# EAGLE design RGB LED 1.4 (EAGLE 5.04)
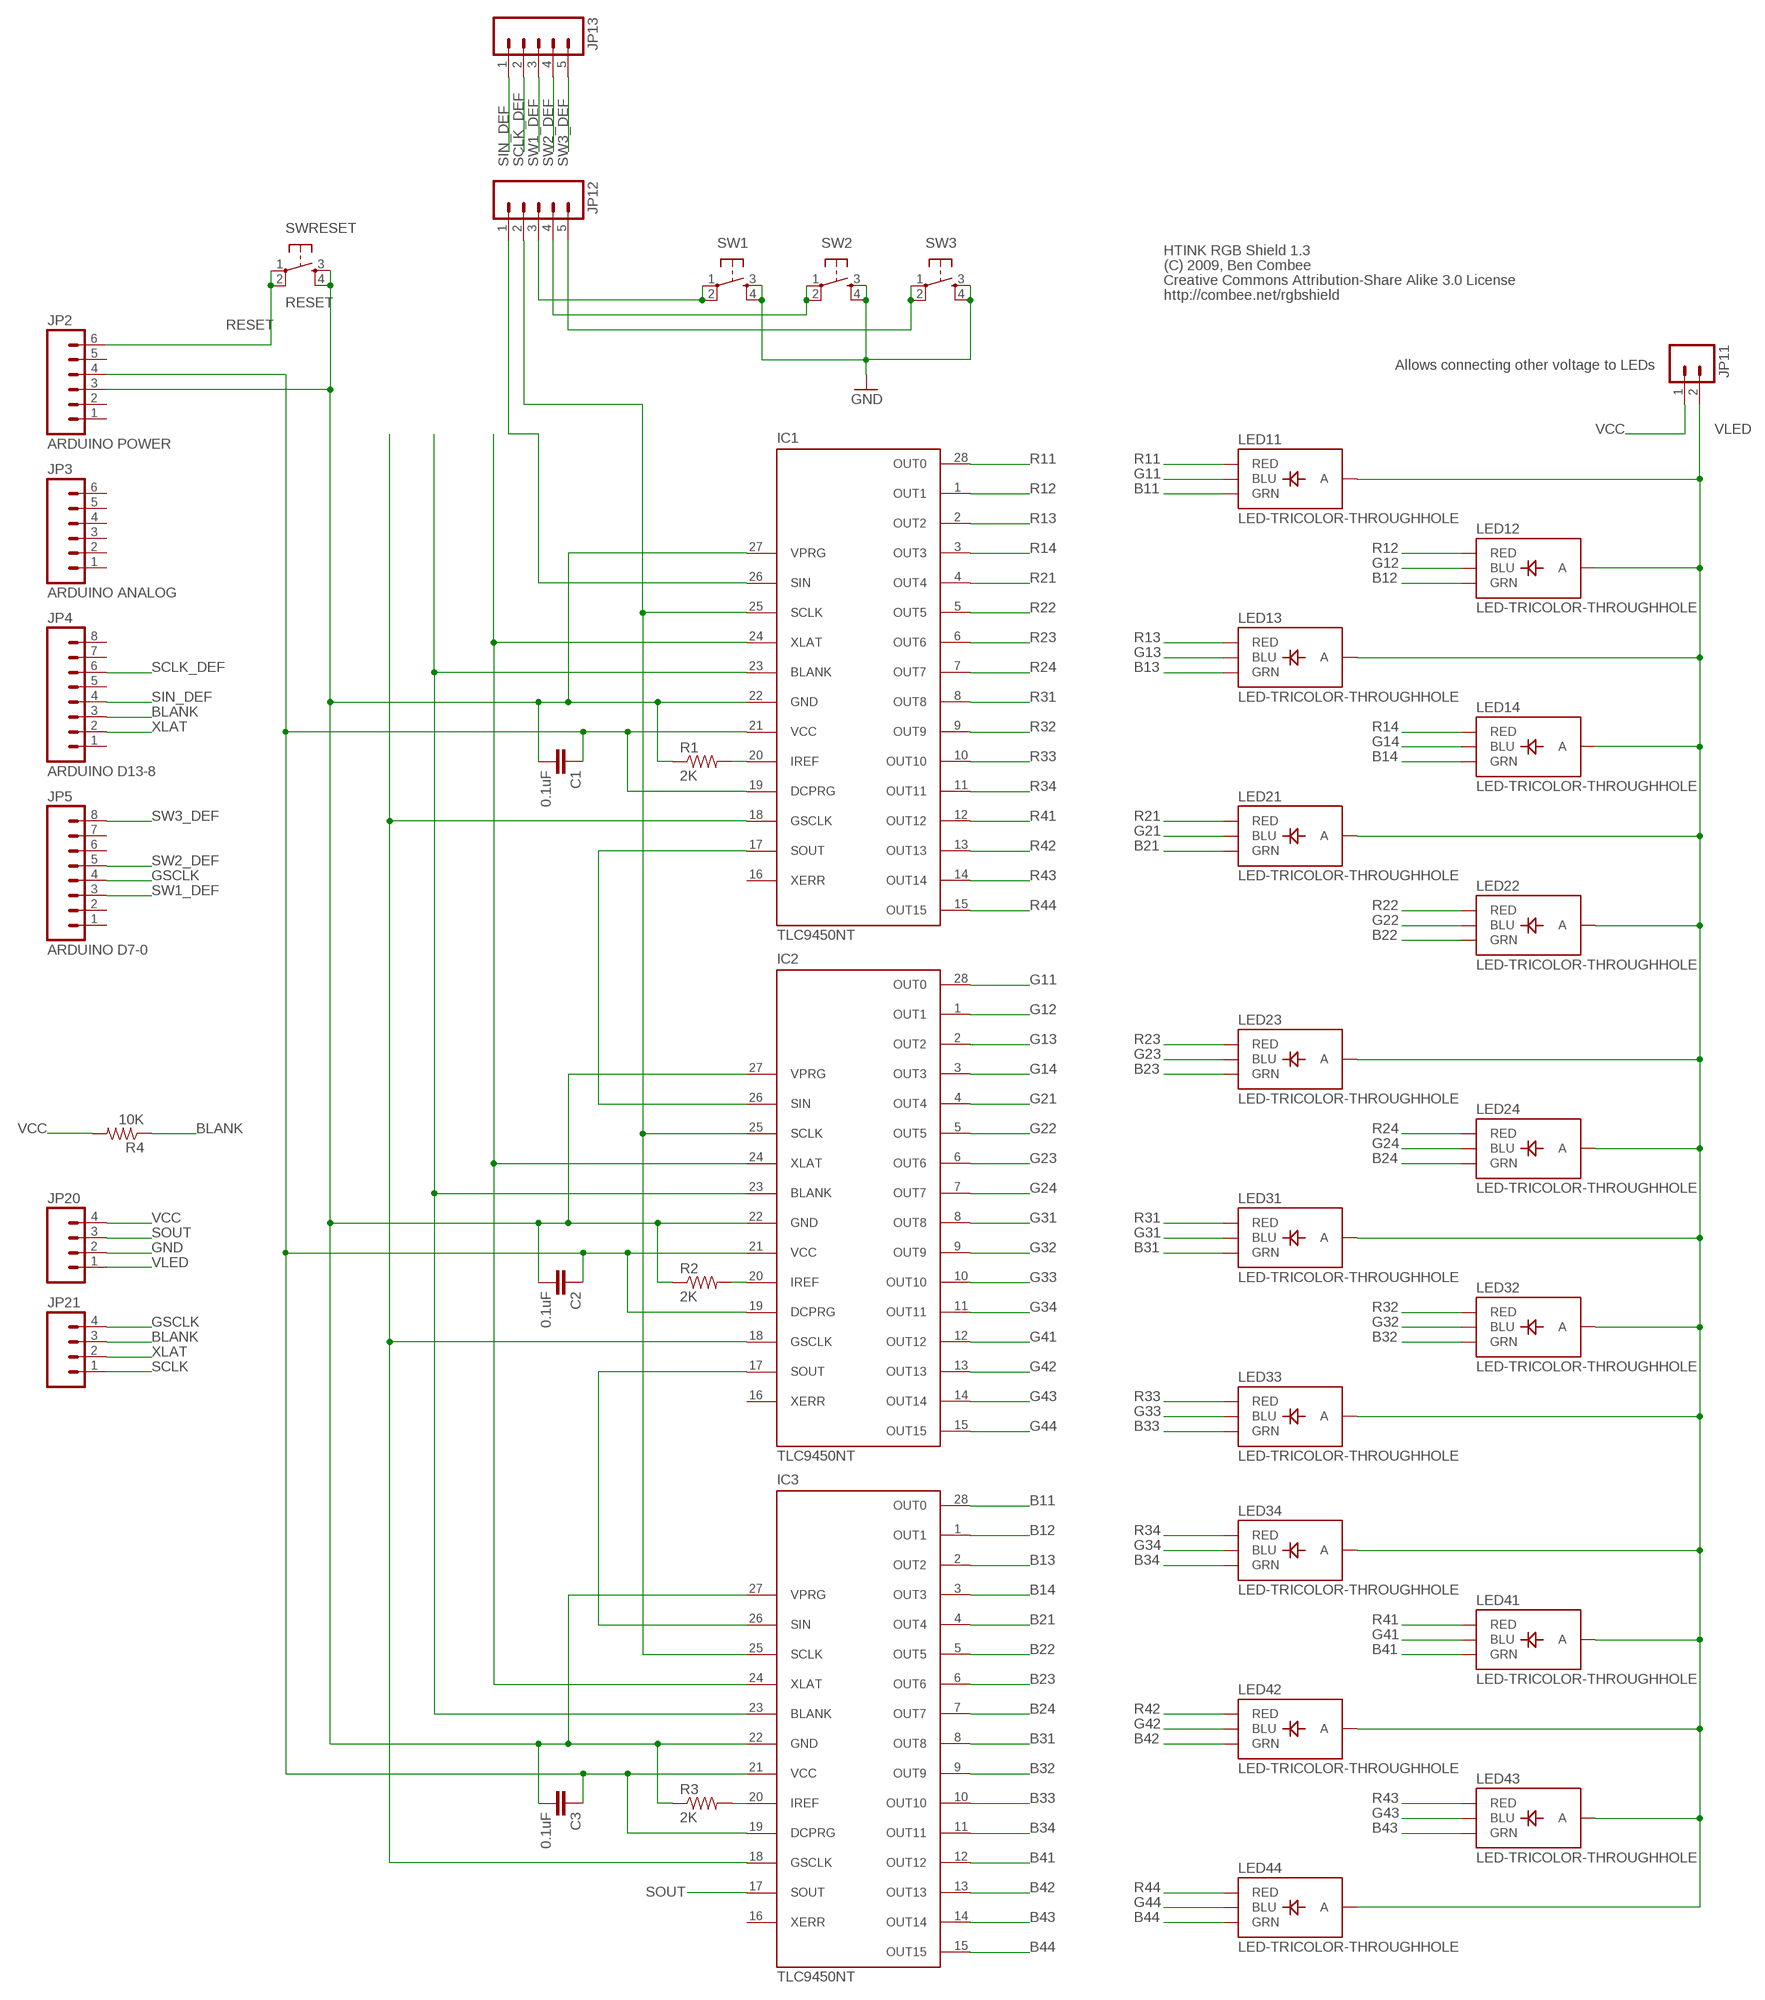
[diagram p0: schematic, sheet 1]

## Parts
C1  0.1uF  CAPPTH  [CAP-PTH-SMALL]
C2  0.1uF  CAPPTH  [CAP-PTH-SMALL]
C3  0.1uF  CAPPTH  [CAP-PTH-SMALL]
IC1  TLC9450NT  [DIL28-3]
IC2  TLC9450NT  [DIL28-3]
IC3  TLC9450NT  [DIL28-3]
JP2  ARDUINO POWER  M06LOCK  [1X06_LOCK]
JP3  ARDUINO ANALOG  M06LOCK  [1X06_LOCK]
JP4  ARDUINO D13-8  M08LOCK  [1X08_LOCK]
JP5  ARDUINO D7-0  M08LOCK  [1X08_LOCK]
JP11  M02LOCK  [1X02_LOCK]
JP12  M05LOCK  [1X05_LOCK]
JP13  M05LOCK  [1X05_LOCK]
JP20  M04LOCK  [1X04_LOCK]
JP21  M04LOCK  [1X04_LOCK]
LED11  LED-TRICOLOR-THROUGHHOLE  [LED-TRICOLOR-THROUGHHOLE]
LED12  LED-TRICOLOR-THROUGHHOLE  [LED-TRICOLOR-THROUGHHOLE]
LED13  LED-TRICOLOR-THROUGHHOLE  [LED-TRICOLOR-THROUGHHOLE]
LED14  LED-TRICOLOR-THROUGHHOLE  [LED-TRICOLOR-THROUGHHOLE]
LED21  LED-TRICOLOR-THROUGHHOLE  [LED-TRICOLOR-THROUGHHOLE]
LED22  LED-TRICOLOR-THROUGHHOLE  [LED-TRICOLOR-THROUGHHOLE]
LED23  LED-TRICOLOR-THROUGHHOLE  [LED-TRICOLOR-THROUGHHOLE]
LED24  LED-TRICOLOR-THROUGHHOLE  [LED-TRICOLOR-THROUGHHOLE]
LED31  LED-TRICOLOR-THROUGHHOLE  [LED-TRICOLOR-THROUGHHOLE]
LED32  LED-TRICOLOR-THROUGHHOLE  [LED-TRICOLOR-THROUGHHOLE]
LED33  LED-TRICOLOR-THROUGHHOLE  [LED-TRICOLOR-THROUGHHOLE]
LED34  LED-TRICOLOR-THROUGHHOLE  [LED-TRICOLOR-THROUGHHOLE]
LED41  LED-TRICOLOR-THROUGHHOLE  [LED-TRICOLOR-THROUGHHOLE]
LED42  LED-TRICOLOR-THROUGHHOLE  [LED-TRICOLOR-THROUGHHOLE]
LED43  LED-TRICOLOR-THROUGHHOLE  [LED-TRICOLOR-THROUGHHOLE]
LED44  LED-TRICOLOR-THROUGHHOLE  [LED-TRICOLOR-THROUGHHOLE]
R1  2K  R-US_0309/12  [0309/12]
R2  2K  R-US_0309/12  [0309/12]
R3  2K  R-US_0309/12  [0309/12]
R4  10K  R-US_0309/12  [0309/12]
SW1  TAC_SWITCHPTH  [TACTILE-PTH]
SW2  TAC_SWITCHPTH  [TACTILE-PTH]
SW3  TAC_SWITCHPTH  [TACTILE-PTH]
SWRESET  RESET  TAC_SWITCHPTH  [TACTILE-PTH]

## Nets
B11: IC3.28(OUT0) LED11.GRN
B12: IC3.1(OUT1) LED12.GRN
B13: IC3.2(OUT2) LED13.GRN
B14: IC3.3(OUT3) LED14.GRN
B21: IC3.4(OUT4) LED21.GRN
B22: IC3.5(OUT5) LED22.GRN
B23: IC3.6(OUT6) LED23.GRN
B24: IC3.7(OUT7) LED24.GRN
B31: IC3.8(OUT8) LED31.GRN
B32: IC3.9(OUT9) LED32.GRN
B33: IC3.10(OUT10) LED33.GRN
B34: IC3.11(OUT11) LED34.GRN
B41: IC3.12(OUT12) LED41.GRN
B42: IC3.13(OUT13) LED42.GRN
B43: IC3.14(OUT14) LED43.GRN
B44: IC3.15(OUT15) LED44.GRN
BLANK: IC1.23(BLANK) IC2.23(BLANK) IC3.23(BLANK) JP4.3 JP21.3 R4.1
G11: IC2.28(OUT0) LED11.BLU
G12: IC2.1(OUT1) LED12.BLU
G13: IC2.2(OUT2) LED13.BLU
G14: IC2.3(OUT3) LED14.BLU
G21: IC2.4(OUT4) LED21.BLU
G22: IC2.5(OUT5) LED22.BLU
G23: IC2.6(OUT6) LED23.BLU
G24: IC2.7(OUT7) LED24.BLU
G31: IC2.8(OUT8) LED31.BLU
G32: IC2.9(OUT9) LED32.BLU
G33: IC2.10(OUT10) LED33.BLU
G34: IC2.11(OUT11) LED34.BLU
G41: IC2.12(OUT12) LED41.BLU
G42: IC2.13(OUT13) LED42.BLU
G43: IC2.14(OUT14) LED43.BLU
G44: IC2.15(OUT15) LED44.BLU
GND: C1.2 C2.2 C3.2 IC1.22(GND) IC1.27(VPRG) IC2.22(GND) IC2.27(VPRG) IC3.22(GND) IC3.27(VPRG) JP2.3 JP20.2 R1.1 R2.1 R3.1 SW1.3 SW1.4 SW2.3 SW2.4 SW3.3 SW3.4 SWRESET.3 SWRESET.4
GSCLK: IC1.18(GSCLK) IC2.18(GSCLK) IC3.18(GSCLK) JP5.4 JP21.4
N$1: IC1.17(SOUT) IC2.26(SIN)
N$2: IC2.17(SOUT) IC3.26(SIN)
N$3: JP12.3 SW1.1 SW1.2
N$4: IC3.20(IREF) R3.2
N$5: IC2.20(IREF) R2.2
N$6: IC1.20(IREF) R1.2
N$32: JP12.4 SW2.1 SW2.2
N$33: JP12.5 SW3.1 SW3.2
R11: IC1.28(OUT0) LED11.RED
R12: IC1.1(OUT1) LED12.RED
R13: IC1.2(OUT2) LED13.RED
R14: IC1.3(OUT3) LED14.RED
R21: IC1.4(OUT4) LED21.RED
R22: IC1.5(OUT5) LED22.RED
R23: IC1.6(OUT6) LED23.RED
R24: IC1.7(OUT7) LED24.RED
R31: IC1.8(OUT8) LED31.RED
R32: IC1.9(OUT9) LED32.RED
R33: IC1.10(OUT10) LED33.RED
R34: IC1.11(OUT11) LED34.RED
R41: IC1.12(OUT12) LED41.RED
R42: IC1.13(OUT13) LED42.RED
R43: IC1.14(OUT14) LED43.RED
R44: IC1.15(OUT15) LED44.RED
RESET: JP2.6 SWRESET.1 SWRESET.2
SCLK: IC1.25(SCLK) IC2.25(SCLK) IC3.25(SCLK) JP12.2 JP21.1
SCLK_DEF: JP4.6 JP13.2
SIN: IC1.26(SIN) JP12.1
SIN_DEF: JP4.4 JP13.1
SOUT: IC3.17(SOUT) JP20.3
SW1_DEF: JP5.3 JP13.3
SW2_DEF: JP5.5 JP13.4
SW3_DEF: JP5.8 JP13.5
VCC: C1.1 C2.1 C3.1 IC1.19(DCPRG) IC1.21(VCC) IC2.19(DCPRG) IC2.21(VCC) IC3.19(DCPRG) IC3.21(VCC) JP2.4 JP11.1 JP20.4 R4.2
VLED: JP11.2 JP20.1 LED11.GND(A) LED12.GND(A) LED13.GND(A) LED14.GND(A) LED21.GND(A) LED22.GND(A) LED23.GND(A) LED24.GND(A) LED31.GND(A) LED32.GND(A) LED33.GND(A) LED34.GND(A) LED41.GND(A) LED42.GND(A) LED43.GND(A) LED44.GND(A)
XLAT: IC1.24(XLAT) IC2.24(XLAT) IC3.24(XLAT) JP4.2 JP21.2
Unconnected: IC1.16(XERR) IC2.16(XERR) IC3.16(XERR) JP2.1 JP2.2 JP2.5 JP3.1 JP3.2 JP3.3 JP3.4 JP3.5 JP3.6 JP4.1 JP4.5 JP4.7 JP4.8 JP5.1 JP5.2 JP5.6 JP5.7

## Notes on the sheet
- HTINK RGB Shield 1.3
- (C) 2009, Ben Combee
- Creative Commons Attribution-Share Alike 3.0 License
- http://combee.net/rgbshield
- Allows connecting other voltage to LEDs

## Library data of the parts
C1-C3 = SparkFun:CAP: Capacitor Standard 0603 ceramic capacitor, and 0.1" leaded capacitor.
IC1-IC3 = combee:TLC9450NT: TI TLC5940 16 Channel LED Driver
JP2 JP3 = SparkFun:M06: Header 6 Standard 6-pin 0.1" header. Use with straight break away headers (SKU : PRT-00116), right angle break away headers (PRT-00553), swiss pins (PRT-00743), machine pins (PRT-00117), and female headers (PRT-00115). Molex polarized connector foot print use with SKU : PRT-08094 with associated crimp pins and housings. NOTES ON THE VARIANTS LOCK and LOCK_LONGPADS... This footprint was designed to help hold the alignment of a through-hole component (i.e. 6-pin header) while soldering it into place. You may notice that each hole has been shifted either up or down by 0.005 of an inch from it's more standard position (which is a perfectly straight line). This slight alteration caused the pins (the squares in the middle) to touch the edges of the holes. Because they are alternating, it causes a "brace" to hold the component in place. 0.005 has proven to be the perfect amount of "off-center" position when using our standard breakaway headers. Although looks a little odd when you look at the bare footprint, once you have a header in there, the alteration is very hard to notice. Also, if you push a header all the way into place, it is covered up entirely on the bottom side. This idea of altering the position of holes to aid alignment will be further integrated into the Sparkfun Library for other footprints. It can help hold any component with 3 or more connection pins.
JP4 JP5 = SparkFun:M08: Header 8 Standard 8-pin 0.1" header. Use with straight break away headers (SKU : PRT-00116), right angle break away headers (PRT-00553), swiss pins (PRT-00743), machine pins (PRT-00117), and female headers (PRT-00115).
JP11 = SparkFun:M02: Header 2 Standard 2-pin 0.1" header. Use with straight break away headers (SKU : PRT-00116), right angle break away headers (PRT-00553), swiss pins (PRT-00743), machine pins (PRT-00117), and female headers (PRT-00115). Molex polarized connector foot print use with SKU : PRT-08233 with associated crimp pins and housings.
JP12 JP13 = SparkFun:M05: Header 5 Standard 5-pin 0.1" header. Use with straight break away headers (SKU : PRT-00116), right angle break away headers (PRT-00553), swiss pins (PRT-00743), machine pins (PRT-00117), and female headers (PRT-00115). Molex polarized connector foot print use with SKU : PRT-08230 with associated crimp pins and housings.
JP20 JP21 = SparkFun:M04: Header 4 Standard 4-pin 0.1" header. Use with straight break away headers (SKU : PRT-00116), right angle break away headers (PRT-00553), swiss pins (PRT-00743), machine pins (PRT-00117), and female headers (PRT-00115). Molex polarized connector foot print use with SKU : PRT-08231 with associated crimp pins and housings.
LED11-LED14 LED21-LED24 LED31-LED34 LED41-LED44 = SparkFun:LED-TRICOLOR-THROUGHHOLE
R1-R4 = resistor:R-US_: RESISTOR, American symbol
SW1-SW3 SWRESET = SparkFun:TAC_SWITCH: Momentary Switch Button commonly used for reset or general input. Spark Fun Electronics SKU : COM-00097

## Board
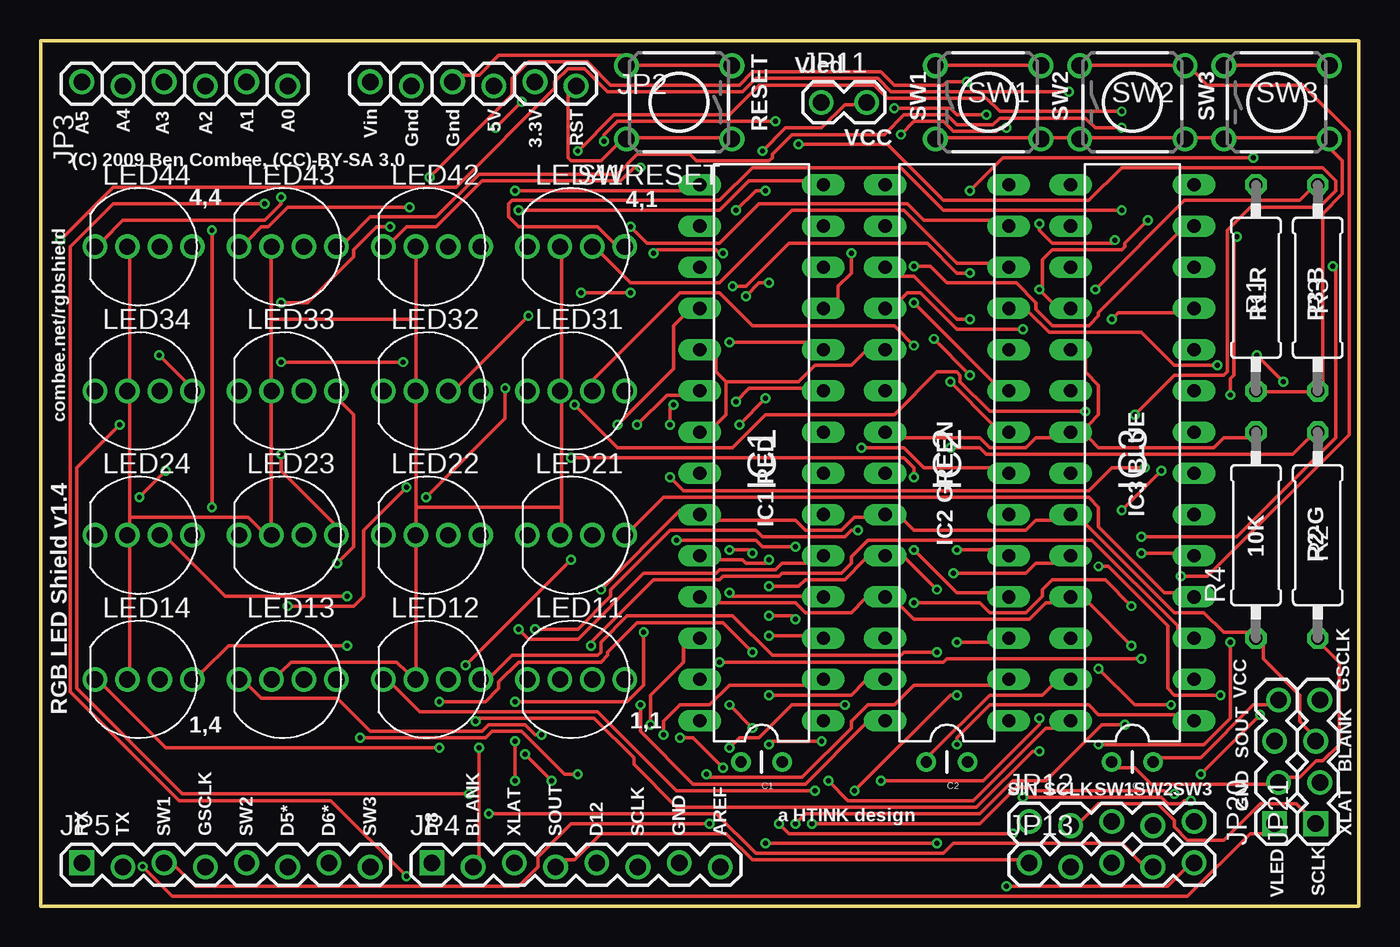
[diagram p1: board, top side]
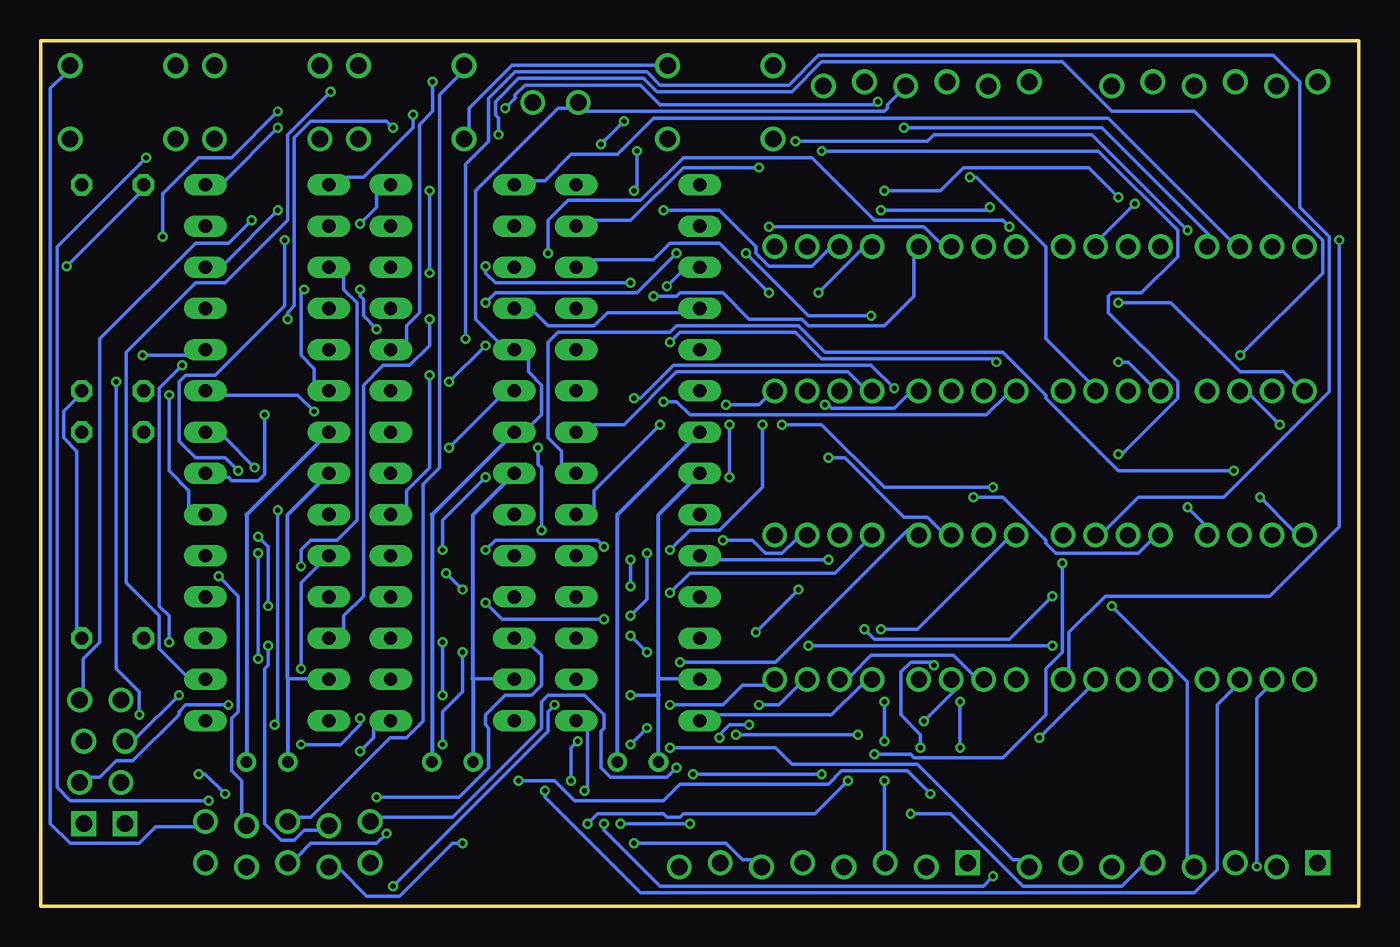
[diagram p2: board, bottom side, seen from below]

Size 81.28 x 53.34 mm. Coordinates in mm from the lower left corner, seen from the top.
Outline: 0,0 81.28,0 81.28,53.34 0,53.34 0,0
Copper layers (1*16): Top 0.035mm / dielectric 1.5mm / Bottom 0.035mm
Design rules "rule_manufacture": minimum track width 8mil, minimum drill 12mil, track to track 8mil, track to pad 8mil, pad to pad 6mil, via to via 10mil, smd to smd 0mil, copper to edge 10mil, drill to drill 10mil, minimum pad ring 10mil, minimum via ring 6mil, stop-mask expansion 2mil, vias tented up to drill 25mil, thermal gap 10mil

### Footprints (pad centres in the part's own frame; a part is rotated, then mirrored left to right if it is on the bottom)
CAP-PTH-SMALL = drill 0.7 round: 1 0,0; 2 2.54,0
DIL28-3 = drill 0.813 long: 1 -16.51,-3.81; 2 -13.97,-3.81; 3 -11.43,-3.81; 4 -8.89,-3.81; 5 -6.35,-3.81; 6 -3.81,-3.81; 7 -1.27,-3.81; 8 1.27,-3.81; 9 3.81,-3.81; 10 6.35,-3.81; 11 8.89,-3.81; 12 11.43,-3.81; 13 13.97,-3.81; 14 16.51,-3.81; 15 16.51,3.81; 16 13.97,3.81; 17 11.43,3.81; 18 8.89,3.81; 19 6.35,3.81; 20 3.81,3.81; 21 1.27,3.81; 22 -1.27,3.81; 23 -3.81,3.81; 24 -6.35,3.81; 25 -8.89,3.81; 26 -11.43,3.81; 27 -13.97,3.81; 28 -16.51,3.81
1X06_LOCK = drill 1.016 round: 1 0,0; 2 2.54,-0.254; 3 5.08,0; 4 7.62,-0.254; 5 10.16,0; 6 12.7,-0.254
1X08_LOCK = drill 1.016 square: 1 0,0.127 | drill 1.016 round: 2 2.54,-0.127; 3 5.08,0.127; 4 7.62,-0.127; 5 10.16,0.127; 6 12.7,-0.127; 7 15.24,0.127; 8 17.78,-0.127
1X02_LOCK = drill 1.016 round: 1 -0.127,0; 2 2.667,0
1X05_LOCK = drill 1.016 round: 1 0,0.127; 2 2.54,-0.127; 3 5.08,0.127; 4 7.62,-0.127; 5 10.16,0.127
1X04_LOCK = drill 1.016 square: 1 0,0.127 | drill 1.016 round: 2 2.54,-0.127; 3 5.08,0.127; 4 7.62,-0.127
LED-TRICOLOR-THROUGHHOLE = drill 1 round: BLU 1,0; GND -1,0; GRN 3,0; RED -3,0
0309/12 = drill 0.813 octagon: 1 -6.35,0; 2 6.35,0
TACTILE-PTH = drill 1.016 round: 1 -3.251,2.261; 2 3.251,2.261; 3 -3.251,-2.261; 4 3.251,-2.261

### Placement (x,y rotation side)
C1  45.72,8.89 180 top
C2  57.15,8.89 180 top
C3  68.58,8.89 180 top
IC1  44.45,27.94 90 top
IC2  55.88,27.94 90 top
IC3  67.31,27.94 90 top
JP2  20.32,50.8 0 top
JP3  2.54,50.8 0 top
JP4  24.13,2.54 0 top
JP5  2.54,2.54 0 top
JP11  48.26,49.53 0 top
JP12  60.96,5.08 0 top
JP13  60.96,2.54 0 top
JP20  76.2,5.08 90 top
JP21  78.74,5.08 90 top
LED11  33.02,13.97 0 top
LED12  24.13,13.97 0 top
LED13  15.24,13.97 0 top
LED14  6.35,13.97 0 top
LED21  33.02,22.86 0 top
LED22  24.13,22.86 0 top
LED23  15.24,22.86 0 top
LED24  6.35,22.86 0 top
LED31  33.02,31.75 0 top
LED32  24.13,31.75 0 top
LED33  15.24,31.75 0 top
LED34  6.35,31.75 0 top
LED41  33.02,40.64 0 top
LED42  24.13,40.64 0 top
LED43  15.24,40.64 0 top
LED44  6.35,40.64 0 top
R1  74.93,38.1 90 top
R2  78.74,22.86 90 top
R3  78.74,38.1 90 top
R4  74.93,22.86 90 top
SW1  58.42,49.53 0 top
SW2  67.31,49.53 0 top
SW3  76.2,49.53 0 top
SWRESET  39.37,49.53 180 top

### Tracks (layer width: path | path; a pad name or v marks a point on that pad's centre or on a via)
B11  (via drill 0.3)
  Top 0.203: v48.56,7.72 49.78,6.5 57.51,6.5 61.98,10.97 62.38,10.97 IC3.28 | v48.16,10.16 45.11,10.16 v44.91,9.96 | v42.47,12.39 v43.89,10.97
  Bottom 0.203: v48.56,7.72 48.56,9.75 v48.16,10.16 | v43.89,10.97 v44.91,9.96 | v42.47,12.39 39.22,12.39 38,13.61 36.58,13.61 LED11.GRN
B12  (via drill 0.3)
  Top 0.203: v56.49,9.96 56.49,10.36 58.52,12.39 64.62,12.39 65.23,11.79 69.9,11.79 IC3.1 | v55.27,15.65 53.24,15.65 53.03,15.44 45.11,15.44 42.67,17.88 36.17,17.88 34.54,16.26 34.54,15.65 34.34,15.44 29.06,15.44 27.84,14.22 LED12.GRN
  Bottom 0.203: v56.49,9.96 56.49,11.99 55.27,13.21 v55.27,15.65
B13  (via drill 0.3)
  Top 0.203: v63.4,50.19 52.43,50.19 51.61,51 44.09,51 43.28,50.19 34.95,50.19 33.53,51.61 32.51,51.61 31.7,50.8 31.7,50.39 25.6,44.3 4.47,44.3 v1.22,41.05
  Bottom 0.203: v63.4,50.19 66.04,47.55 66.04,42.27 69.9,38.41 71.73,38.41 76,34.14 76,19.91 73.97,17.88 73.97,15.85 72.34,14.22 IC3.2 | v1.22,41.05 1.22,23.37 5.49,19.1 15.65,19.1 17.88,16.87 17.88,14.63 LED13.GRN
B14  (via drill 0.3)
  Top 0.203: v33.93,16.05 33.93,16.26 37.8,20.12 41.86,20.12 42.06,20.32 45.52,20.32 45.72,20.52 49.38,20.52 49.99,21.13 49.99,21.54 51,22.55 64.82,22.55 70.1,17.27 70.1,17.07 IC3.3 | v18.9,16.05 11.58,16.05 9.96,14.43 LED14.GRN
  Bottom 0.203: v18.9,16.05 v33.93,16.05
B21
  Top 0.203: IC3.4 69.9,19.3 69.29,19.3 65.23,23.37 65.23,24.59 64.62,25.2 38.41,25.2 36.58,23.37 LED21.GRN
B22  (via drill 0.3)
  Top 0.203: v67.87,21.74 69.9,21.74 IC3.5 | v67.87,15.24 55.88,15.24 55.68,15.04 v41.86,15.04
  Bottom 0.203: v67.87,15.24 v67.87,21.74 | v41.86,15.04 35.97,15.04 27.84,23.16 LED22.GRN
B23  (via drill 0.3)
  Top 0.203: v73.36,31.5 73.36,32.51 73.56,32.72 73.56,41.05 v73.76,41.25 | v66.65,48.97 59.13,48.97 58.32,49.78 52.22,49.78 51.41,50.6 44.3,50.6 42.47,48.77 35.36,48.77 v33.12,46.53 | v14.83,27.84 14.83,26.82 18.09,23.57 LED23.GRN
  Bottom 0.203: v73.36,31.5 73.36,26.82 72.14,25.6 72.14,24.59 IC3.6 | v73.76,41.25 73.76,43.89 71.53,46.13 69.49,46.13 v66.65,48.97 | v33.12,46.53 16.05,46.53 11.18,41.66 11.18,40.03 13.41,37.8 15.24,37.8 15.44,37.59 15.44,36.58 11.18,32.31 11.18,31.29 14.63,27.84 v14.83,27.84
B24  (via drill 0.3)
  Top 0.203: v67.46,30.28 69.9,32.72 72.95,32.72 73.15,32.92 73.15,41.66 74.57,43.08 78.84,43.08 79.86,44.09 79.86,44.7 79.05,45.52 66.65,45.52 64.62,43.48 55.68,43.48 52.22,46.94 v46.74,46.94 | v45.31,48.36 35.56,48.36 34.75,47.55 v34.75,47.14 | v10.57,24.59 v10.57,41.66
  Bottom 0.203: v67.46,30.28 67.46,26.62 67.87,26.21 69.49,26.21 69.7,26.42 69.9,26.42 IC3.7 | v45.31,48.36 v46.74,46.94 | v34.75,47.14 26.62,47.14 26.21,47.55 16.46,47.55 v10.57,41.66 | v10.57,24.59 9.55,23.57 LED24.GRN
B31  (via drill 0.3)
  Top 0.203: v68.07,27.03 66.04,27.03 64.62,25.6 39.62,25.6 v38.81,26.42 | v38.81,29.67 38.81,30.68 v39.01,30.89
  Bottom 0.203: v68.07,27.03 69.9,28.85 IC3.8 | v38.81,26.42 v38.81,29.67 | v39.01,30.89 36.98,30.89 36.58,31.29 LED31.GRN
B32  (via drill 0.3)
  Top 0.203: v64.41,30.48 58.52,30.48 56.69,32.31 56.69,32.72 56.49,32.92 55.27,32.92 52.63,30.28 44.7,30.28 42.67,28.25 35.56,28.25 v32.92,30.89
  Bottom 0.203: v64.41,30.48 65.43,31.5 69.9,31.5 IC3.9 | v32.92,30.89 32.72,30.89 32.51,30.68 28.65,30.68 27.84,31.5 LED32.GRN
B33  (via drill 0.3)
  Top 0.203: v76.61,32.31 v74.98,33.93 | v71.53,8.13 v75.18,11.79 | v69.9,6.91 69.49,6.91 69.29,7.11 61.16,7.11 60.96,7.32 60.15,7.32 57.91,5.08 v47.55,5.08 | v29.87,9.35 v31.5,7.72 | v18.29,21.13 19.3,22.15 19.3,30.28 18.49,31.09 LED33.GRN
  Bottom 0.203: v74.98,33.93 72.34,33.93 IC3.10 | v76.61,32.31 76.61,14.63 75.18,13.21 v75.18,11.79 | v71.53,8.13 71.12,8.13 v69.9,6.91 | v47.55,5.08 46.94,5.69 42.88,5.69 42.67,5.49 41.86,5.49 41.66,5.69 33.53,5.69 v31.5,7.72 | v29.87,9.35 27.64,9.35 27.43,9.14 21.95,9.14 19.3,11.79 19.3,14.63 18.29,15.65 v18.29,21.13
B34  (via drill 0.3)
  Top 0.203: v66.04,36.17 66.45,36.58 69.9,36.58 IC3.11 | v59.54,47.95 59.13,47.95 58.93,47.75 56.29,47.75 55.68,48.36 53.85,48.36 v53.03,47.55 | v7.32,33.93 8.94,32.31 LED34.GRN
  Bottom 0.203: v66.04,36.17 66.04,36.58 65.63,36.98 65.63,47.35 64.62,48.36 59.94,48.36 v59.54,47.95 | v53.03,47.55 53.03,48.56 53.24,48.77 53.24,49.58 51.82,51 44.09,51 43.28,50.19 34.95,50.19 33.12,52.02 18.29,52.02 15.24,48.97 10.16,48.97 2.23,41.05 2.23,39.01 v7.32,33.93
B41  (via drill 0.3)
  Top 0.203: v66.65,42.88 55.68,42.88 53.03,45.52 43.89,45.52 41.86,43.48 29.06,43.48 28.85,43.28 28.85,42.47 29.46,41.86 34.34,41.86 35.36,40.84 LED41.GRN
  Bottom 0.203: v66.65,42.88 69.9,39.62 IC3.12
B42  (via drill 0.3)
  Top 0.203: v53.85,39.42 54.86,39.42 55.88,38.41 60.15,38.41 61.37,37.19 61.37,36.78 62.38,35.76 64.62,35.76 65.23,36.37 65.23,36.58 70.1,41.45 IC3.13 | v44.91,38.41 44.3,38.41 v43.48,37.59
  Bottom 0.203: v53.85,39.42 53.85,39.01 53.24,38.41 v44.91,38.41 | v43.48,37.59 42.06,37.59 41.86,37.8 39.22,37.8 37.59,36.17 34.34,36.17 33.93,35.76 29.26,35.76 27.43,37.59 27.43,40.03 LED42.GRN
B43  (via drill 0.3)
  Top 0.203: v66.65,47.95 65.02,47.95 64.41,48.56 59.13,48.56 58.73,48.16 56.49,48.16 55.88,48.77 53.24,48.77 52.02,47.55 46.33,47.55 45.11,46.33 45.11,46.13 44.91,45.92 40.44,45.92 40.03,46.33 36.78,46.33 35.56,45.11 27.03,45.11 24.38,42.47 20.32,42.47 18.9,41.05 LED43.GRN
  Bottom 0.203: v66.65,47.95 69.9,44.7 IC3.14
B44  (via drill 0.3)
  Top 0.203: v58.32,48.77 56.49,48.77 56.08,49.17 v52.63,49.17 | v28.04,47.95 v29.67,49.58
  Bottom 0.203: v58.32,48.77 58.32,47.95 61.37,44.91 62.38,44.91 IC3.15 | v52.63,49.17 52.02,49.78 52.02,49.99 51.41,50.6 44.3,50.6 43.08,49.38 29.87,49.38 v29.67,49.58 | v28.04,47.95 15.85,47.95 9.14,41.25 LED44.GRN
BLANK  (via drill 0.3)
  Top 0.203: JP21.3 78.23,10.77 77.62,11.38 77.62,13.01 75.39,15.24 75.39,16.05 R4.1 74.37,16.87 72.95,16.87 71.73,18.09 69.9,18.09 64.41,23.57 IC3.23 62.38,23.77 61.37,23.77 60.76,23.16 53.85,23.16 53.24,23.77 IC2.23 50.8,23.98 50.19,23.98 49.38,23.16 47.14,23.16 46.53,23.77 41.86,23.77 IC1.23 39.42,24.38 v34.54,19.51 | v29.26,7.72 v29.26,10.16 | v29.26,12.6 36.17,12.6 37.19,13.61 v37.19,16.87
  Bottom 0.203: v29.26,7.72 29.26,3.25 JP4.3 | v29.26,10.16 v29.26,12.6 | v37.19,16.87 v34.54,19.51
G11  (via drill 0.3)
  Top 0.203: v36.98,12.39 36.98,10.77 40.23,7.52 47.14,7.52 50.8,11.18 IC2.28
  Bottom 0.203: v36.98,12.39 35.76,12.39 34.54,13.61 LED11.BLU
G12  (via drill 0.3)
  Top 0.203: v61.57,9.55 61.16,9.55 57.71,6.1 39.22,6.1 36.58,8.74 36.58,9.14 34.14,11.58 27.03,11.58 v26.82,11.38
  Bottom 0.203: v61.57,9.55 60.76,10.36 60.76,10.97 IC2.1 | v26.82,11.38 24.79,13.41 LED12.BLU
G13  (via drill 0.3)
  Top 0.203: v41.05,8.13 41.25,7.92 46.94,7.92 49.99,10.97 49.99,11.38 51,12.39 52.63,12.39 53.85,13.61 58.52,13.61 IC2.2 | v33.12,8.13 32.31,8.13 29.67,10.77 27.84,10.77 27.43,10.36 v19.71,10.36
  Bottom 0.203: v33.12,8.13 v41.05,8.13 | v19.71,10.36 16.66,13.41 LED13.BLU
G14  (via drill 0.3)
  Top 0.203: v56.49,16.26 58.52,16.26 IC2.3 | v56.49,13.01 56.08,13.01 v50.19,7.11
  Bottom 0.203: v56.49,13.01 v56.49,16.26 | v50.19,7.11 50.19,6.71 44.3,0.81 10.16,0.81 8.74,2.23 8.74,12.39 7.72,13.41 LED14.BLU
G21  (via drill 0.3)
  Top 0.203: v53.85,21.95 56.49,19.3 58.52,19.3 IC2.4 | v46.53,22.15 44.5,22.15 44.09,22.55 v39.22,22.55
  Bottom 0.203: v53.85,21.95 53.24,22.55 46.94,22.55 v46.53,22.15 | v39.22,22.55 37.39,22.55 36.58,21.74 35.56,21.74 34.75,22.55 LED21.BLU
G22  (via drill 0.3)
  Top 0.203: v56.49,21.95 58.52,21.95 IC2.5 | v53.85,26.42 53.85,27.03 53.24,27.64 v32.72,27.64
  Bottom 0.203: v56.49,21.95 56.49,23.77 v53.85,26.42 | v32.72,27.64 31.7,27.64 28.04,23.98 26.62,23.98 25.81,23.16 LED22.BLU
G23  (via drill 0.3)
  Top 0.203: v55.07,34.95 v57.3,32.72
  Bottom 0.203: v57.3,32.72 57.3,27.03 58.73,25.6 58.73,24.59 IC2.6 | v55.07,34.95 55.07,45.72 53.65,47.14 53.65,49.78 52.02,51.41 43.89,51.41 43.08,50.6 35.15,50.6 33.33,52.43 5.28,52.43 3.66,50.8 3.66,43.08 1.83,41.25 1.83,31.7 8.33,25.2 13.61,25.2 15.65,23.16 LED23.BLU
G24  (via drill 0.3)
  Top 0.203: v50.6,28.25 53.24,28.25 54.46,27.03 58.52,27.03 IC2.7 | v50.39,23.16 49.99,23.16 49.58,22.76 44.5,22.76 44.09,23.16 38.81,23.16 35.15,19.51 35.15,19.1 33.12,17.07 v30.48,17.07 | v18.9,19.1 11.38,19.1 7.92,22.55 LED24.BLU
  Bottom 0.203: v50.6,28.25 50.6,27.23 50.39,27.03 v50.39,23.16 | v30.48,17.07 29.87,16.46 21.54,16.46 v18.9,19.1
G31  (via drill 0.3)
  Top 0.203: v56.08,32.31 58.73,29.67 IC2.8 | v53.85,34.54 52.63,35.76 43.89,35.76 41.86,37.8 39.42,37.8 33.93,32.31 LED31.BLU
  Bottom 0.203: v53.85,34.54 v56.08,32.31
G32  (via drill 0.3)
  Top 0.203: v53.85,37.19 58.73,32.31 IC2.9 | v42.06,40.23 41.86,40.23 41.66,40.44 38,40.44 v37.8,40.23 | v30.07,36.37 25.81,32.11 LED32.BLU
  Bottom 0.203: v53.85,37.19 53.24,37.8 44.5,37.8 v42.06,40.23 | v37.8,40.23 33.93,36.37 v30.07,36.37
G33  (via drill 0.3)
  Top 0.203: v57.1,50.8 55.88,50.8 55.68,50.6 52.63,50.6 51.82,51.41 43.89,51.41 43.08,50.6 35.15,50.6 33.73,52.02 30.07,52.02 29.06,51 29.06,49.99 v23.98,44.91
  Bottom 0.203: v57.1,50.8 57.1,48.97 57.91,48.16 57.91,36.58 58.73,35.76 58.73,34.75 IC2.10 | v23.98,44.91 23.57,44.91 19.3,40.64 19.3,34.95 16.66,32.31 LED33.BLU
G34  (via drill 0.3)
  Top 0.203: v72.54,33.33 69.9,33.33 67.87,35.36 62.18,35.36 60.96,36.58 IC2.11 | v73.36,16.26 73.36,11.58 71.73,9.96 v65.23,9.96 | v61.57,11.58 61.57,11.18 58.12,7.72 v51.82,7.72 | v26.42,6.91 8.74,6.91 2.23,13.41 2.23,27.03 v4.88,29.67
  Bottom 0.203: v72.54,33.33 73.97,31.9 73.97,18.49 73.36,17.88 v73.36,16.26 | v65.23,9.96 62.79,9.96 61.57,11.18 v61.57,11.58 | v51.82,7.72 49.58,7.72 48.36,6.5 42.88,6.5 41.86,7.52 32.72,7.52 31.9,8.33 27.84,8.33 v26.42,6.91 | v4.88,29.67 6.71,31.5 LED34.BLU
G41
  Top 0.203: IC2.12 58.52,39.62 56.49,39.62 53.24,42.88 46.33,42.88 41.86,38.41 36.37,38.41 34.54,40.23 LED41.BLU
G42  (via drill 0.3)
  Top 0.203: v36.37,41.86 37.39,40.84 41.86,40.84 44.3,43.28 53.44,43.28 54.46,42.27 58.52,42.27 IC2.13
  Bottom 0.203: v36.37,41.86 26.82,41.86 25.81,40.84 LED42.BLU
G43  (via drill 0.3)
  Top 0.203: v61.57,42.06 61.57,41.66 62.38,40.84 66.04,40.84 v66.24,41.05 | v66.65,24.38 v69.09,26.82 | v66.85,11.18 65.43,11.18 61.98,7.72 59.94,7.72 57.91,5.69 47.14,5.69 v46.53,5.08 | v22.55,1.83 17.88,6.5 8.53,6.5 1.83,13.21 1.83,40.64 4.47,43.28 v13.82,43.28
  Bottom 0.203: v61.57,42.06 60.55,43.08 60.55,43.89 IC2.14 | v66.24,41.05 66.24,36.98 70.51,32.72 72.34,32.72 72.75,32.31 72.75,28.65 71.73,27.64 69.9,27.64 v69.09,26.82 | v66.65,24.38 66.65,11.38 v66.85,11.18 | v46.53,5.08 46.53,4.67 43.08,1.22 23.16,1.22 v22.55,1.83 | v13.82,43.28 15.85,41.25 LED43.BLU
G44
  Bottom 0.203: IC2.15 50.8,44.7 50.19,44.7 48.56,46.33 45.72,46.33 43.48,48.56 15.44,48.56 7.92,41.05 LED44.BLU
GND  (via drill 0.3)
  Top 0.203: v44.91,13.01 49.99,13.01 50.8,13.82 IC2.27 | C3.2 66.45,8.53 67.46,8.53 68.48,7.52 75.59,7.52 JP20.2 77.01,7.92 77.62,7.92 78.64,8.94 79.05,8.94 80.06,9.96 80.06,15.04 79.05,16.05 R2.1 | C2.2 54.86,9.35 58.52,13.01 61.77,13.01 62.38,13.61 IC3.27 | JP2.3 26.01,51.21 27.03,51.21 28.25,52.43 35.76,52.43 SWRESET.4 36.78,51.82 42.06,51.82 SWRESET.3 | R1.1 75.39,31.7 78.23,31.7 R3.1 79.05,32.31 79.05,42.67 80.26,43.89 80.26,45.92 79.65,46.53 SW3.4 78.84,47.35 73.56,47.35 SW3.3 72.34,47.35 71.12,47.35 SW2.4 69.9,47.35 64.62,47.35 SW2.3 63.4,47.35 62.38,47.35 SW1.4 60.96,47.35 55.88,47.35 SW1.3
  Bottom 0.203: IC1.27 41.86,14.02 43.18,14.02 | IC2.27 53.24,14.02 54.61,14.02 54.66,14.02 | 43.18,13.01 v44.91,13.01 | 66.04,14.02 64.62,14.02 IC3.27 | R2.1 79.05,17.07 79.05,28.04 79.86,28.85 79.86,30.48 79.05,31.29 R3.1 | SWRESET.3 43.28,51.82 52.22,51.82 54.86,49.17 54.86,47.95 SW1.3
  Bottom 0.254: C1.2 43.18,13.01 43.18,14.02 43.18,24.13 IC1.22 | C2.2 54.61,14.02 54.61,24.13 IC2.22 | C3.2 66.04,14.02 66.04,24.13 IC3.22
GSCLK  (via drill 0.3)
  Top 0.203: v60.55,35.56 56.49,35.56 54.25,37.8 53.44,37.8 53.03,37.39 IC2.18 | IC3.18 62.38,37.19 v61.57,38 61.77,38.2 61.77,39.83 62.38,40.44 66.65,40.44 66.85,40.64 66.85,40.84 v68.28,42.27 | v15.24,18.49 19.3,18.49 19.91,19.1 19.91,23.16 v22.55,25.81 | v35.56,29.67 39.01,33.12 39.01,35.76 39.62,36.37 IC1.18
  Bottom 0.203: IC1.18 41.86,36.58 46.33,36.58 47.14,35.76 49.99,35.76 50.8,36.58 IC2.18 | v61.57,38 61.57,37.59 61.37,37.39 61.37,36.37 v60.55,35.56 | v15.24,18.49 10.57,13.82 10.57,3.05 JP5.4 | v22.55,25.81 29.26,25.81 33.12,29.67 v35.56,29.67 | v68.28,42.27 69.7,40.84 71.73,40.84 77.62,34.95 77.62,16.26 78.64,15.24 78.64,13.41 JP21.4
N$1  (via drill 0.3)
  Top 0.203: v42.67,38.2 43.48,38.2 46.13,40.84 54.66,40.84 56.49,39.01 v57.3,39.01 | v57.3,44.09 59.33,46.13 v74.78,46.13 | v70.92,6.5 70.51,6.5 70.31,6.3 69.49,6.3 69.09,6.71 v60.55,6.71
  Bottom 0.203: v42.67,38.2 41.86,39.01 IC1.17 | v57.3,44.09 v57.3,39.01 | v74.78,46.13 80.26,40.64 80.26,7.32 79.45,6.5 v70.92,6.5 | v60.55,6.71 55.47,6.71 53.65,8.53 53.65,10.97 53.85,11.18 53.85,11.79 52.63,13.01 51,13.01 50.39,13.61 50.39,15.44 51,16.05 IC2.26
N$2  (via drill 0.3)
  Top 0.203: v57.3,36.17 56.49,36.17 53.85,38.81 53.03,38.81 IC2.17
  Bottom 0.203: v57.3,36.17 57.3,34.54 58.52,33.33 60.15,33.33 61.37,32.11 61.37,19.1 62.59,17.88 62.59,17.07 IC3.26
N$3
  Top 0.203: SW1.2 60.96,51.82 55.88,51.82 SW1.1
  Bottom 0.203: JP12.3 65.43,5.49 64.62,5.49 59.74,10.36 58.73,10.36 57.71,11.38 57.71,26.01 56.69,27.03 56.69,49.99 55.47,51.21 SW1.1
N$4  (via drill 0.3)
  Top 0.203: v65.02,38 70.51,43.48 77.62,43.48 78.23,44.09 R3.2
  Bottom 0.203: v65.02,38 65.23,37.8 65.23,33.93 64.41,33.12 64.41,32.31 IC3.20
N$5  (via drill 0.3)
  Top 0.203: v56.08,28.25 57.91,28.25 58.32,27.84 77.22,27.84 78.23,28.85 R2.2
  Bottom 0.203: v56.08,28.25 53.03,31.29 IC2.20
N$6  (via drill 0.3)
  Top 0.203: v36.78,29.67 38.61,31.5 39.42,31.5 IC1.20 | v42.47,21.95 43.69,21.95 v43.89,21.74 | v44.91,17.88 46.33,17.88 v46.53,17.68 | v53.85,18.69 57.91,18.69 58.52,18.09 60.76,18.09 61.77,19.1 61.77,19.51 62.38,20.12 65.63,20.12 v67.26,18.49 | v67.87,22.76 73.76,22.76 79.86,28.85 79.86,39.22 v79.65,39.42
  Bottom 0.203: v36.78,29.67 36.78,25.81 39.42,23.16 41.25,23.16 v42.47,21.95 | v43.89,21.74 43.89,18.9 v44.91,17.88 | v46.53,17.68 52.83,17.68 v53.85,18.69 | v67.26,18.49 67.26,22.15 v67.87,22.76 | v79.65,39.42 75.18,43.89 R1.2
N$32  (via drill 0.3)
  Top 0.203: SW2.1 64.62,51.82 69.9,51.82 SW2.2 71.12,51.41 71.93,50.6 77.83,50.6 80.67,47.75 80.67,29.06 71.93,20.32 v70.31,20.32
  Bottom 0.203: v70.31,20.32 69.09,19.1 69.09,11.99 69.49,11.58 69.49,8.33 68.89,7.72 68.89,5.69 JP12.4
N$33
  Top 0.203: SW3.1 73.56,51.82 78.84,51.82 SW3.2
  Bottom 0.203: JP12.5 71.73,4.88 74.17,4.88 75.18,3.86 79.45,3.86 80.67,5.08 80.67,50.39 79.86,51.21 SW3.2
R11
  Bottom 0.203: IC1.28 39.42,11.79 32.51,11.79 30.68,13.61 LED11.RED
R12  (via drill 0.3)
  Top 0.203: v47.75,7.11 39.22,7.11 34.34,11.99 23.37,11.99 21.74,13.61 LED12.RED
  Bottom 0.203: v47.75,7.11 47.55,7.32 47.55,10.97 IC1.1
R13  (via drill 0.3)
  Top 0.203: v38.41,10.57 38.41,11.38 39.42,12.39 41.25,12.39 42.47,13.61 47.14,13.61 IC1.2 | v30.89,10.57 30.48,10.57 29.87,11.18 27.64,11.18 27.23,10.77 20.32,10.77 18.29,12.8 13.61,12.8 12.8,13.61 LED13.RED
  Bottom 0.203: v30.89,10.57 v38.41,10.57
R14  (via drill 0.3)
  Top 0.203: v44.91,16.66 47.14,16.66 IC1.3 | v43.89,15.65 42.06,17.48 36.78,17.48 34.95,15.65 34.95,15.44 34.54,15.04 29.46,15.04 28.25,13.82 28.25,13.41 27.43,12.6 v24.59,12.6 | v24.59,9.75 7.72,9.75 3.86,13.61 LED14.RED
  Bottom 0.203: v43.89,15.65 v44.91,16.66 | v24.59,9.75 v24.59,12.6
R21  (via drill 0.3)
  Top 0.203: v42.47,19.3 42.67,19.1 47.14,19.1 IC1.4
  Bottom 0.203: v42.47,19.3 41.25,20.52 32.31,20.52 30.48,22.35 LED21.RED
R22  (via drill 0.3)
  Top 0.203: v29.46,17.07 30.07,16.46 33.12,16.46 37.19,20.52 41.66,20.52 41.86,20.73 45.31,20.73 45.72,21.13 47.14,21.13 IC1.5
  Bottom 0.203: v29.46,17.07 27.23,17.07 21.74,22.55 LED22.RED
R23  (via drill 0.3)
  Top 0.203: v44.7,31.29 v43.08,29.67 | v28.65,31.9 28.65,30.07 v23.77,25.2
  Bottom 0.203: v43.08,29.67 47.14,25.6 47.14,24.59 IC1.6 | v44.7,31.29 44.3,31.29 42.27,33.33 30.07,33.33 v28.65,31.9 | v23.77,25.2 21.95,25.2 19.3,22.55 19.3,22.35 18.69,21.74 13.61,21.74 12.8,22.55 LED23.RED
R24  (via drill 0.3)
  Top 0.203: v6.1,25.2 v7.72,26.82
  Bottom 0.203: v7.72,26.82 14.83,26.82 19.3,31.29 19.3,31.5 21.95,34.14 32.92,34.14 34.54,35.76 42.06,35.76 42.47,35.36 49.38,35.36 49.99,34.75 49.99,28.85 49.17,28.04 49.17,27.23 IC1.7 | v6.1,25.2 4.06,23.16 LED24.RED
R31
  Bottom 0.203: IC1.8 47.14,29.67 45.31,29.67 42.06,32.92 31.5,32.92 30.68,32.11 LED31.RED
R32  (via drill 0.3)
  Top 0.203: v42.88,31.09 43.69,31.9 47.14,31.9 IC1.9
  Bottom 0.203: v42.88,31.09 42.06,31.09 41.25,30.28 22.96,30.28 21.74,31.5 LED32.RED
R33  (via drill 0.3)
  Top 0.203: v42.47,34.75 47.14,34.75 IC1.10 | v14.83,33.53 v22.35,33.53
  Bottom 0.203: v42.47,34.75 41.86,35.36 34.75,35.36 33.12,33.73 22.55,33.73 v22.35,33.53 | v14.83,33.53 14.22,33.53 12.8,32.11 LED33.RED
R34  (via drill 0.3)
  Top 0.203: v49.99,40.23 49.99,39.01 49.17,38.2 49.17,37.39 IC1.11 | v21.54,41.86 20.73,41.86 19.3,40.44 19.3,40.03 16.46,37.19 v14.83,37.19
  Bottom 0.203: v49.99,40.23 49.99,42.27 48.77,43.48 44.3,43.48 41.66,46.13 33.73,46.13 29.87,42.27 21.95,42.27 v21.54,41.86 | v14.83,37.19 11.58,37.19 7.32,32.92 4.67,32.92 3.86,32.11 LED34.RED
R41  (via drill 0.3)
  Top 0.203: v33.33,37.8 v36.37,37.8
  Bottom 0.203: v36.37,37.8 39.42,40.84 42.47,40.84 43.48,39.83 47.14,39.83 IC1.12 | v33.33,37.8 30.68,40.44 LED41.RED
R42  (via drill 0.3)
  Top 0.203: v36.98,45.52 36.58,45.52 35.76,44.7 27.23,44.7 24.38,41.86 22.55,41.86 21.74,41.05 LED42.RED
  Bottom 0.203: v36.98,45.52 41.66,45.52 44.91,42.27 47.14,42.27 IC1.13
R43  (via drill 0.3)
  Top 0.203: v29.46,42.88 41.86,42.88 43.69,44.7 47.14,44.7 IC1.14 | v22.76,43.08 15.24,43.08 14.02,41.86 13.61,41.86 12.8,41.05 LED43.RED
  Bottom 0.203: v29.46,42.88 22.96,42.88 v22.76,43.08
R44  (via drill 0.3)
  Top 0.203: v29.26,44.09 39.42,44.09 IC1.15 | v14.83,43.69 14.83,43.28 13.82,42.27 5.08,42.27 3.86,41.05 LED44.RED
  Bottom 0.203: v29.26,44.09 25.81,44.09 24.38,45.52 16.66,45.52 v14.83,43.69
RESET
  Top 0.203: SWRESET.1 42.06,47.35 36.78,47.35 SWRESET.2 35.56,46.94 34.54,45.92 32.72,45.92 32.51,46.13 32.51,49.99 JP2.6
SCLK  (via drill 0.3)
  Top 0.203: JP12.2 64.21,5.28 65.23,6.3 68.89,6.3 69.9,5.28 69.9,4.88 70.71,4.06 72.95,4.06 75.18,6.3 77.42,6.3 78.03,5.69 JP21.1 | IC1.25 41.86,18.69 46.53,18.69 47.14,18.09 49.99,18.09 50.8,18.9 IC2.25 53.03,18.49 53.85,17.68 60.96,17.68 61.98,18.69 62.38,18.69 IC3.25 64.62,18.69 v67.26,16.05
  Bottom 0.203: v67.26,16.05 67.26,14.83 67.46,14.63 67.46,5.08 66.45,4.06 65.63,4.06 65.02,4.67 64.21,4.67 JP12.2
SCLK_DEF  (via drill 0.3)
  Top 0.203: v44.7,3.86 v55.27,3.86
  Bottom 0.203: v44.7,3.86 39.01,3.86 38,2.85 37.39,2.85 JP4.6 | v55.27,3.86 55.88,3.86 59.13,0.61 61.16,0.61 62.79,2.23 JP13.2
SIN  (via drill 0.3)
  Top 0.203: v37.59,11.18 37.59,13.01 39.62,15.04 39.62,16.05 IC1.26 | v39.42,10.36 40.23,10.36 v42.06,8.53
  Bottom 0.203: v37.59,11.18 38.81,11.18 39.42,10.57 v39.42,10.36 | v42.06,8.53 42.67,7.92 46.13,7.92 46.74,8.53 46.74,10.77 46.53,10.97 46.53,11.79 47.75,13.01 49.99,13.01 50.39,12.6 50.39,10.97 55.88,5.49 60.35,5.49 JP12.1
SIN_DEF
  Top 0.203: JP4.4 32.31,2.85 32.92,2.85 34.54,4.47 42.27,4.47 43.89,2.85 60.35,2.85 JP13.1
SOUT  (via drill 0.3)
  Top 0.203: v65.23,20.93 65.84,20.93 69.49,17.27 69.49,13.41 69.9,13.01 v72.75,13.01
  Bottom 0.203: v65.23,20.93 65.23,21.95 64.62,22.55 62.99,22.55 61.77,23.77 61.77,37.19 62.59,38 62.59,38.81 IC3.17 | v72.75,13.01 75.39,10.36 JP20.3
SW1_DEF  (via drill 0.3)
  Top 0.203: v41.25,5.08 32.72,5.08 30.68,3.05 30.68,2.44 29.46,1.22 9.55,1.22 8.33,2.44 JP5.3 | v45.52,5.08 46.13,4.47 v59.94,4.47
  Bottom 0.203: v41.25,5.08 v45.52,5.08 | v59.94,4.47 60.55,3.86 64.62,3.86 65.43,3.05 JP13.3
SW2_DEF  (via drill 0.3)
  Top 0.203: v27.64,5.69 41.66,5.69 44.09,3.25 55.68,3.25 56.29,3.86 66.65,3.86 67.87,2.64 JP13.4
  Bottom 0.203: v27.64,5.69 25.2,5.69 20.73,1.22 14.63,1.22 13.41,2.44 JP5.5
SW3_DEF  (via drill 0.3)
  Top 0.203: v42.47,9.75 43.08,10.36 44.3,10.36 46.33,12.39 v49.58,12.39 | v59.54,1.22 69.49,1.22 70.51,2.23 JP13.5
  Bottom 0.203: v42.47,9.75 35.97,9.75 34.95,8.74 27.23,8.74 21.34,2.85 20.93,2.85 JP5.8 | v49.58,12.39 49.99,11.99 49.99,10.77 v59.54,1.22
VCC
  Top 0.203: IC3.19 64.41,33.73 64.41,32.92 65.23,32.11 65.23,30.28 64.62,29.67 IC3.21 | R4.2 74.37,28.85 72.95,28.85 72.34,28.25 65.23,28.25 64.62,28.85 IC3.21 | JP20.4 75.59,12.39 74.78,12.39 71.53,9.14 69.09,9.14 C3.1 | 42.27,32.31 41.66,32.92 41.66,33.73 IC1.19 | 42.27,32.31 42.27,30.28 41.66,29.67 IC1.21 | 42.27,32.31 46.74,32.31 47.75,33.33 49.99,33.33 50.8,34.14 IC2.19 | IC3.21 62.38,28.85 61.37,28.85 60.76,28.25 58.52,28.25 57.91,28.85 53.24,28.85 IC2.21
  Bottom 0.203: IC2.21 51,29.67 50.39,30.28 50.39,32.11 51.21,32.92 51.21,33.73 IC2.19 53.03,34.75 54.46,36.17 54.46,44.09 49.38,49.17 48.77,49.17 JP11.1 47.75,48.97 29.26,48.97 29.06,49.17 29.06,49.38 28.45,49.99 JP2.4
  Bottom 0.254: C1.1 45.72,24.13 IC1.21 | C2.1 57.15,24.13 IC2.21 | C3.1 68.58,24.13 IC3.21
VLED  (via drill 0.3)
  Top 0.203: 14.22,36.17 14.22,32.31 LED33.GND 14.22,31.09 14.22,23.57 LED23.GND 13.61,23.16 12.8,23.98 5.49,23.98 | 14.22,36.17 14.22,40.03 LED43.GND | LED13.GND 14.83,14.43 15.44,15.04 21.95,15.04 22.55,14.43 LED12.GND 23.16,14.63 23.16,22.15 LED22.GND 23.16,23.57 23.16,24.59 | 23.16,24.59 23.16,31.09 LED32.GND 23.16,32.31 23.16,36.17 | 23.16,36.17 23.16,40.03 LED42.GND | 14.22,36.17 23.16,36.17 | 32.11,24.59 32.11,31.09 LED31.GND 32.11,32.31 32.11,40.03 LED41.GND | 32.11,24.59 32.11,23.57 LED21.GND | v44.5,46.53 45.92,47.95 48.16,47.95 49.58,49.38 50.19,49.38 JP11.2 | v44.7,44.09 44.09,44.09 v42.88,42.88 | 23.16,24.59 32.11,24.59 | LED14.GND 5.49,14.63 5.49,22.15 LED24.GND 5.49,23.57 5.49,23.98 | 5.49,23.98 5.49,31.09 LED34.GND 5.49,32.31 5.49,40.03 LED44.GND | v6.3,2.44 8.13,0.61 70.71,0.61 74.57,4.47 75.39,4.47 JP20.1
  Bottom 0.203: LED11.GND 31.29,14.22 30.07,15.44 24.99,15.44 23.77,14.22 LED12.GND | v44.5,46.53 44.5,44.3 v44.7,44.09 | v42.88,42.88 39.42,42.88 37.19,40.64 37.19,40.23 36.37,39.42 33.73,39.42 32.72,40.44 LED41.GND | v6.3,2.44 6.3,12.8 5.69,13.41 LED14.GND
XLAT  (via drill 0.3)
  Top 0.203: v44.91,21.34 44.7,21.13 43.48,21.13 43.28,21.34 41.86,21.34 IC1.24 | v44.91,19.71 46.74,19.71 47.14,20.12 49.58,20.12 50.8,21.34 IC2.24 53.24,21.54 v55.27,19.51 | v56.29,20.52 60.76,20.52 61.37,21.13 62.38,21.13 IC3.24 | v27.03,9.75 27.03,3.05 JP4.2 | v26.21,14.83 v32.72,21.34 | v69.7,12.39 67.46,12.39 v65.23,14.63
  Bottom 0.203: v44.91,21.34 v44.91,19.71 | v55.27,19.51 v56.29,20.52 | v27.03,9.75 27.03,10.57 28.25,11.79 28.25,14.43 27.64,15.04 26.42,15.04 v26.21,14.83 | v32.72,21.34 39.42,21.34 IC1.24 | v69.7,12.39 72.34,12.39 72.75,11.99 72.75,11.79 75.59,8.94 76.61,8.94 77.62,7.92 78.23,7.92 JP21.2 | v65.23,14.63 65.23,19.91 64.01,21.13 IC3.24

### Text on the board
tPlace: Vled | A5 | A4 | A3 | A2 | A1 | A0 | Vin | Gnd | Gnd | 5V | 3.3V | RST | RESET | SW1 | SW2 | SW3 | VCC | (C) 2009 Ben Combee, (CC)-BY-SA 3.0 | 4,4 | 4,1 | R1-R | R3-B | combee.net/rgbshield | IC3 BLUE | 10K | IC1 RED | IC2 GREEN | R2-G | GSCLK | VCC | RGB LED Shield v1.4 | SOUT | BLANK | 1,4 | 1,1 | SIN | SCLK | SW1 | SW2 | SW3 | GND | XLAT | a HTINK design | RX | TX | SW1 | GSCLK | SW2 | D5* | D6* | SW3 | D8 | BLANK | XLAT | SOUT | D12 | SCLK | GND | AREF | VLED | SCLK